# Altium schematic sheet 01_MCU.SchDoc
size A4
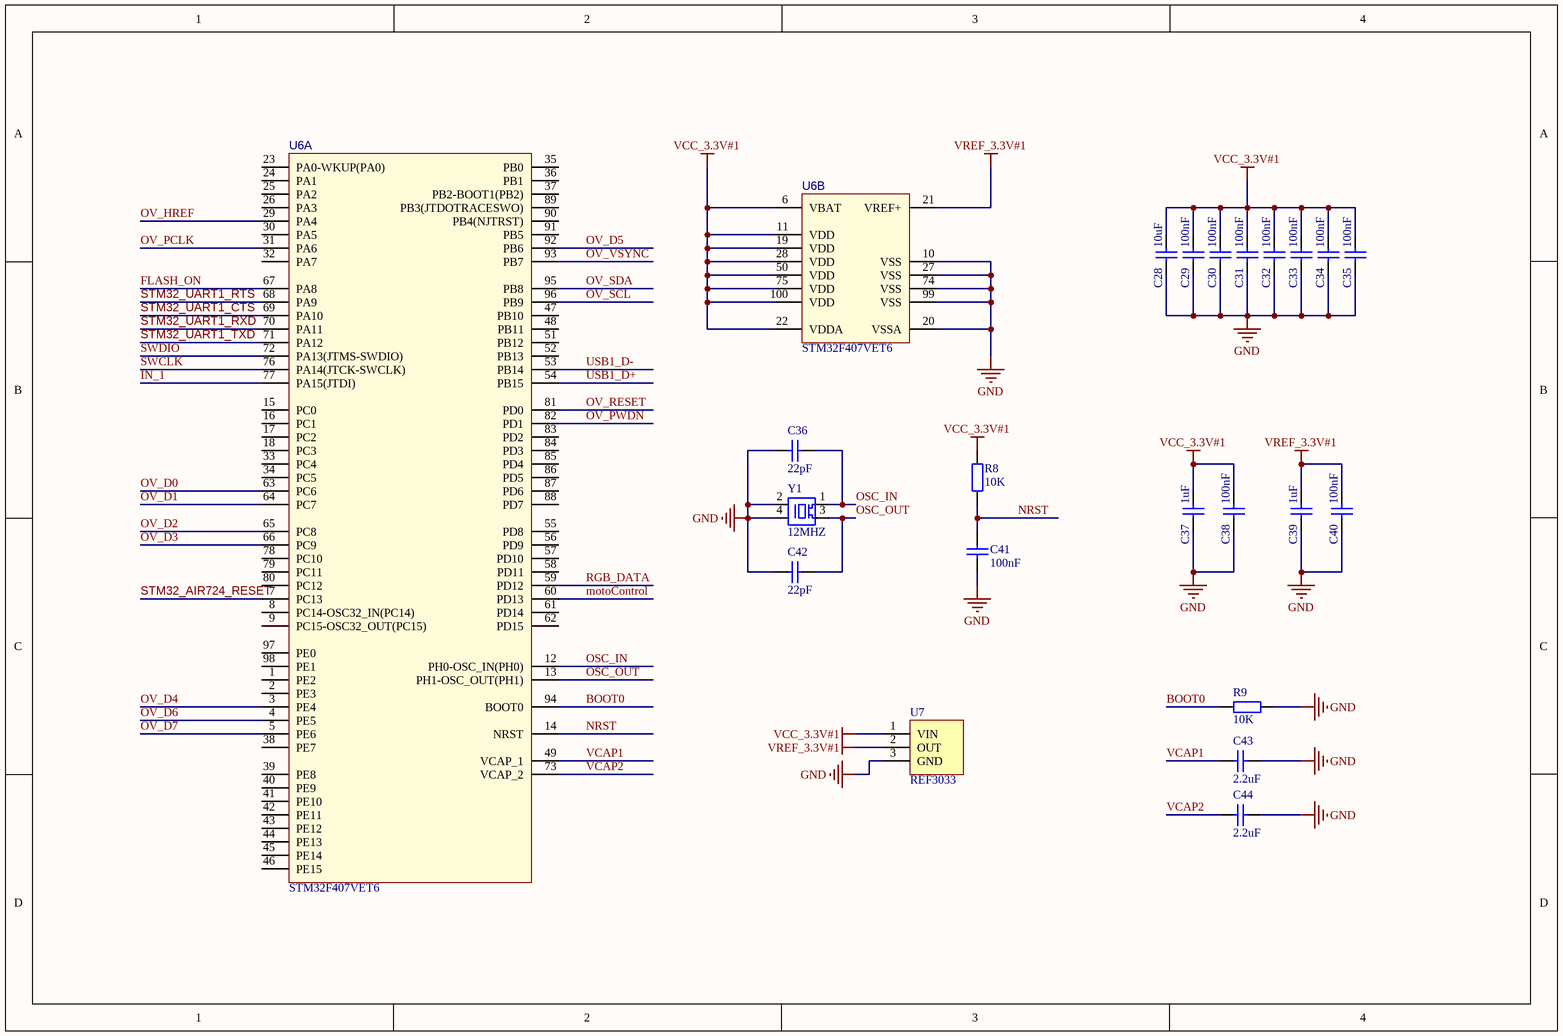
[diagram p0: 01_MCU.SchDoc]

## Parts
C28  10uF  [0603-C]
C29  100nF  [0603-C]
C30  100nF  [0603-C]
C31  100nF  [0603-C]
C32  100nF  [0603-C]
C33  100nF  [0603-C]
C34  100nF  [0603-C]
C35  100nF  [0603-C]
C36  22pF  [0603-C]
C37  1uF  [0603-C]
C38  100nF  [0603-C]
C39  1uF  [0603-C]
C40  100nF  [0603-C]
C41  100nF  [0603-C]
C42  22pF  [0603-C]
C43  2.2uF  [0603-C]
C44  2.2uF  [0603-C]
R8  10K  [0603-R]
R9  10K  [0603-R]
U6  STM32F407VET6  [STM32F407VET6]  (parts A,B of 2)
U7  REF3033  [REF3033]
Y1  12MHZ  [3225]

## Nets
GND: C28.1 C29.1 C30.1 C31.1 C32.1 C33.1 C34.1 C35.1 C36.1 C37.1 C38.1 C39.1 C40.1 C41.1 C42.1 C43.2 C44.2 R9.1 U6.10(VSS) U6.20(VSSA) U6.27(VSS) U6.74(VSS) U6.99(VSS) U7.3(GND) Y1.2(GND) Y1.4(GND)
VCC_3.3V#1: C28.2 C29.2 C30.2 C31.2 C32.2 C33.2 C34.2 C35.2 C37.2 C38.2 R8.2 U6.6(VBAT) U6.11(VDD) U6.19(VDD) U6.22(VDDA) U6.28(VDD) U6.50(VDD) U6.75(VDD) U6.100(VDD) U7.1(VIN)
VREF_3.3V#1: C39.2 C40.2 U6.21(VREF+) U7.2(OUT)
BOOT0: R9.2 U6.94(BOOT0)
FLASH_ON: U6.67(PA8)
IN_1: U6.77(PA15(JTDI))
motoControl: U6.60(PD13)
NRST: C41.2 R8.1 U6.14(NRST)
OSC_IN: C36.2 U6.12(PH0-OSC_IN(PH0)) Y1.1(XTAL1)
OSC_OUT: C42.2 U6.13(PH1-OSC_OUT(PH1)) Y1.3(XTAL3)
OV_D0: U6.63(PC6)
OV_D1: U6.64(PC7)
OV_D2: U6.65(PC8)
OV_D3: U6.66(PC9)
OV_D4: U6.3(PE4)
OV_D5: U6.92(PB6)
OV_D6: U6.4(PE5)
OV_D7: U6.5(PE6)
OV_HREF: U6.29(PA4)
OV_PCLK: U6.31(PA6)
OV_PWDN: U6.82(PD1)
OV_RESET: U6.81(PD0)
OV_SCL: U6.96(PB9)
OV_SDA: U6.95(PB8)
OV_VSYNC: U6.93(PB7)
RGB_DATA: U6.59(PD12)
STM32_AIR724_RESET: U6.7(PC13)
STM32_UART1_CTS: U6.69(PA10)
STM32_UART1_RTS: U6.68(PA9)
STM32_UART1_RXD: U6.70(PA11)
STM32_UART1_TXD: U6.71(PA12)
SWCLK: U6.76(PA14(JTCK-SWCLK))
SWDIO: U6.72(PA13(JTMS-SWDIO))
USB1_D+: U6.54(PB15)
USB1_D-: U6.53(PB14)
VCAP1: C43.1 U6.49(VCAP_1)
VCAP2: C44.1 U6.73(VCAP_2)

Not connected (* = marked no-connect by the designer): U6 1(PE2) 2(PE3) 8(PC14-OSC32_IN(PC14)) 9(PC15-OSC32_OUT(PC15)) 15(PC0) 16(PC1) 17(PC2) 18(PC3) 23(PA0-WKUP(PA0)) 24(PA1) 25(PA2) 26(PA3) 30(PA5) 32(PA7) 33(PC4) 34(PC5) 35(PB0) 36(PB1) 37(PB2-BOOT1(PB2)) 38(PE7) 39(PE8) 40(PE9) 41(PE10) 42(PE11) 43(PE12) 44(PE13) 45(PE14) 46(PE15) 47(PB10) 48(PB11) 51(PB12) 52(PB13) 55(PD8) 56(PD9) 57(PD10) 58(PD11) 61(PD14) 62(PD15) 78(PC10) 79(PC11) 80(PC12) 83(PD2) 84(PD3) 85(PD4) 86(PD5) 87(PD6) 88(PD7) 89(PB3(JTDOTRACESWO)) 90(PB4(NJTRST)) 91(PB5) 97(PE0) 98(PE1)

## Library data of the parts
C28-C44 = C: 贴片电容; BOM名称: 无极性贴片电容; 联系卖家，免费查找封装: 唯一出售店铺网址https://shop463601444.taobao.com
R8 R9 = R: 贴片电阻; 联系卖家，免费查找封装: 唯一出售店铺网址https://shop463601444.taobao.com; BOM名称: 贴片电阻
U6 = STM32F407VET6: Manufacturer: ST(意法半导体); Add into BOM: yes; CPU Core: ARM Cortex-M4; CPU Maximum Speed: 168MHz; Operating Voltage Range: 1.8V~3.6V; Program Storage Size: 512KB; Program Memory Type: FLASH; RAM Size: 192KB; GPIO Ports Number: 82; ADC (Bit): 12bit; Universal Serial Bus: 有; Peripheral/Function: DMA；LCD/LED驱动；PWM; tags: STM32; Name: STM32F407VET6; Symbol: STM32F407VET6; Device: STM32F407VET6; LCSC Part Name: STM32F407VET6; Supplier Part: C28730; Manufacturer Part: STM32F407VET6; Supplier Footprint: LQFP-100(14x14); JLCPCB Part Class: Extended Part; Datasheet: https://atta.szlcsc.com/upload/public/pdf/source/20140801/1457707197138.pdf; Supplier: LCSC; Convert to PCB: yes; EEPROM: -; DAC (Bit): 12bit; PWM (Bit): -; Internal Comparator: -; communication protocol: -; Watchdog: 有; Real-Time Clock: -; Infrared Data Association: 有; Low-Voltage Detect: 有; CCP Capture/Compare: -; LCD Module: 有; Secure Digital Input and Output: -; Direct Memory Access: 有; Internal Oscillator: 有; Operating Temperature Range: -40℃~+85℃; image: http://image.lceda.cn/szlcsc/C28730.jpg
Y1 = Y: 无源晶振